# Altium schematic sheet Sheet_1_2025-12-29.schdoc
size 195 x 101 mm
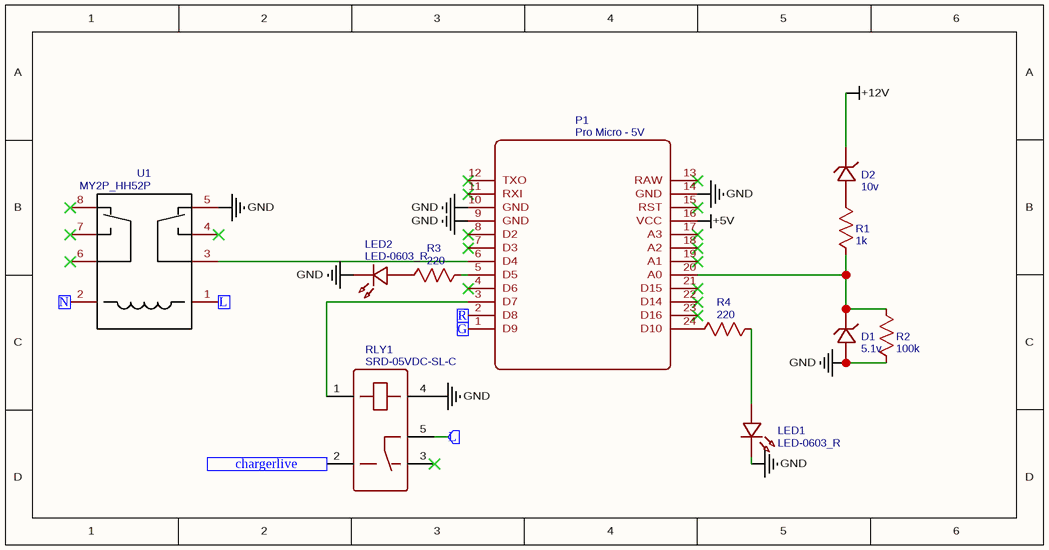
[diagram p0: Sheet_1_2025-12-29.schdoc]

## Parts
D1  5.1v  [DO-41_BD2.4-L4.7-P8.70-D0.9-RD]
D2  10v  [DO-41_BD2.4-L4.7-P8.70-D0.9-RD]
LED1  LED-0603_R  [LED0603_RED]
LED2  LED-0603_R  [LED0603_RED]
P1  Pro Micro - 5V  [PRO MICRO - 5V]
R1  1k  [R0603]
R2  100k  [R0603]
R3  220  [R0603]
R4  220  [R0603]
RLY1  SRD-05VDC-SL-C  [RELAY-TH_SRD-XXVDC-XL-C]
U1  MY2P_HH52P  [MY2P_HH52P]

## Ports
chargerlive (in), G (in), L (in), N (in), R (in)

## Nets
+5V: P1.16(VCC)
+12V: D2.1
GND: D1.2 LED1.2 LED2.2 P1.9(GND) P1.10(GND) P1.14(GND) R2.2 RLY1.4 U1.5
chargerlive: RLY1.2 ; port chargerlive
G: P1.1(D9) ; port G
L: RLY1.5 U1.1 ; port L
N: U1.2 ; port N
R: P1.2(D8) ; port R
NetD1_1: D1.1 P1.20(A0) R1.2 R2.1
NetD2_2: D2.2 R1.1
NetLED1_1: LED1.1 R4.2
NetLED2_1: LED2.1 R3.1
NetP1_3: P1.3(D7) RLY1.1
NetP1_5: P1.5(D5) R3.2
NetP1_6: P1.6(D4) U1.3
NetP1_24: P1.24(D10) R4.1

Not connected (* = marked no-connect by the designer): P1 4(D6)* 7(D3)* 8(D2)* 11(RXI)* 12(TXO)* 13(RAW)* 15(RST)* 17(A3)* 18(A2)* 19(A1)* 21(D15)* 22(D14)* 23(D16)*; RLY1 3*; U1 4* 6* 7* 8*

## Library data of the parts
D1 = 5.1v: Manufacturer: Multicomp; Manufacturer Part: 1N4740A; Contributor: LCSC; Supplier: LCSC; Supplier Part: C194121; JLCPCB Part Class: Extended Part; spicePre: D; spiceSymbolName: 1N4740A_C194121
D2 = 10v: Manufacturer: Multicomp; Manufacturer Part: 1N4740A; Contributor: LCSC; Supplier: LCSC; Supplier Part: C194121; JLCPCB Part Class: Extended Part; spicePre: D; spiceSymbolName: 1N4740A_C194121
LED1 LED2 = LED-0603_R: Manufacturer: EVERLIGHT(台湾亿光); Manufacturer Part: 19-217/R6C-AL1M2VY/3T; Contributor: LCEDA_01; Supplier Part: C72044; Supplier: LCSC; spicePre: L; spiceSymbolName: LED-0603_R
P1 = Pro Micro - 5V: sourceId: 1T5FDZYC8; timeStamp: 1460375612; spicePre: P; spiceSymbolName: Pro Micro - 5V
R1 = 1k: nameAlias: Value(Ω); Contributor: LCEDA_Lib; spicePre: R; spiceSymbolName: R_0603_US
R2 = 100k: nameAlias: Value(Ω); Contributor: LCEDA_Lib; spicePre: R; spiceSymbolName: R_0603_US
R3 R4 = 220: nameAlias: Value(Ω); Contributor: LCEDA_Lib; spicePre: R; spiceSymbolName: R_0603_US
RLY1 = SRD-05VDC-SL-C: Manufacturer: 松乐; Supplier: LCSC; Manufacturer Part: SRD-05VDC-SL-C; Supplier Part: C35449; JLCPCB Part Class: Extended Part; spicePre: R; spiceSymbolName: SRD-05VDC-SL-C
U1 = MY2P_HH52P: Manufacturer: Fuji Electric; Contributor: Владислав Красильников; link: https://datasheet.octopart.com/HH52P-DC24V-Fuji-Electric-datasheet-31827798.pdf; spicePre: U; spiceSymbolName: MY2P_HH52P